# Altium project Camera_Shield.PrjPcb
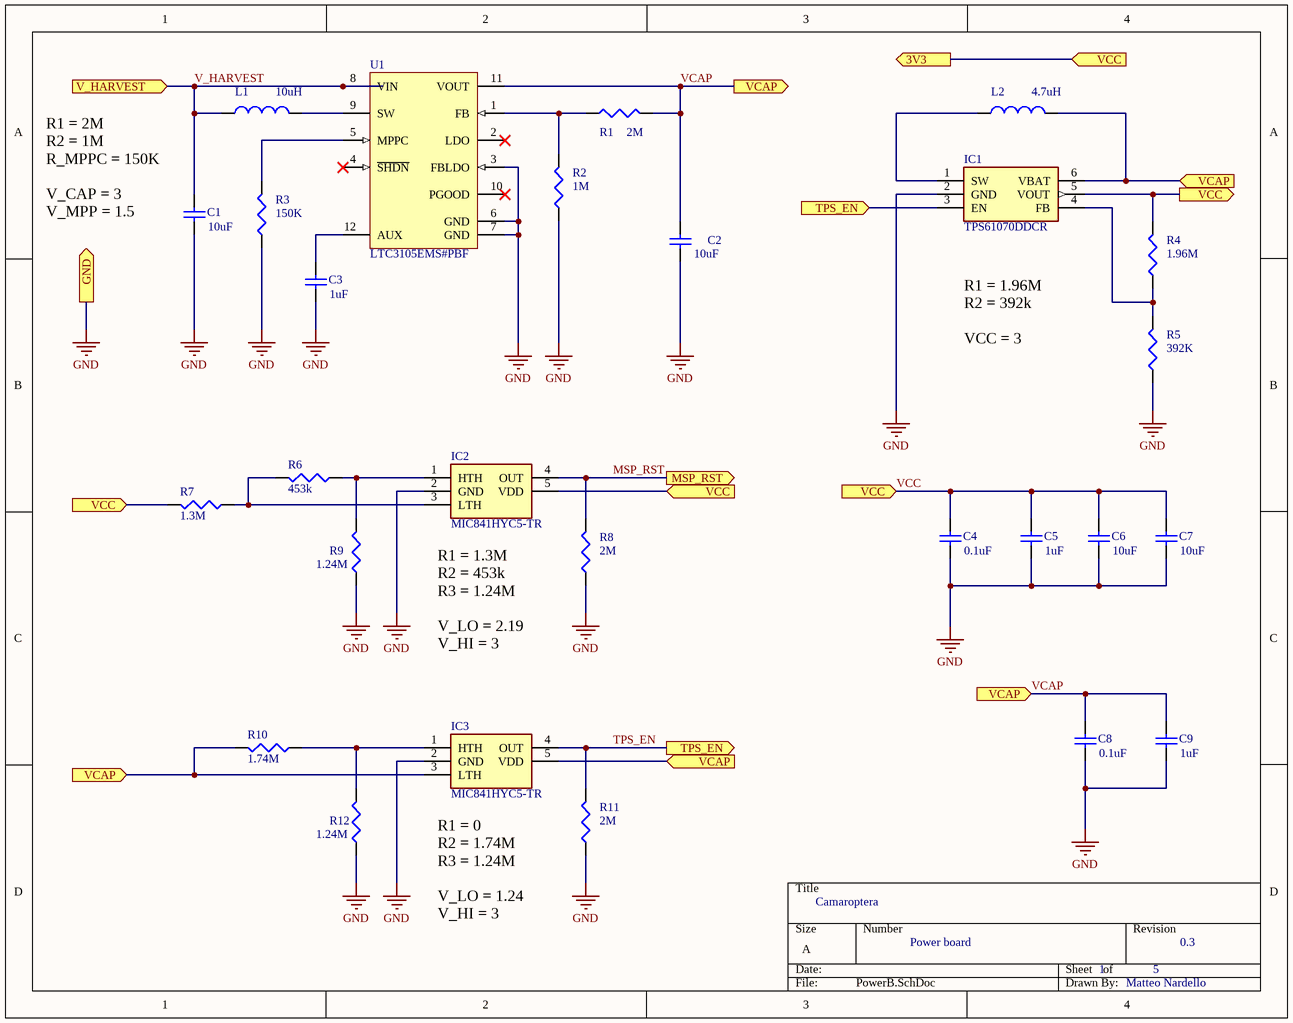
[diagram p0: PowerB.SchDoc]
5 sheets, 52 parts. Net scope: flat (ports and power ports of the same name join across sheets).
Board file: PCB1v3.PcbDoc
Sheets:
  PowerB.SchDoc
  Camera.SchDoc
  Radio.SchDoc
  ALS.SchDoc
  Connectors.SchDoc

## Sheet PowerB.SchDoc
size A

### Parts
C1  value 10uF  [1608[0603]]  (hidden comment: Cap)
C2  value 10uF  [1608[0603]]  (hidden comment: Cap)
C3  value 1uF  [1608[0603]]  (hidden comment: Cap)
C4  value 0.1uF  [1608[0603]]  (hidden comment: Cap)
C5  value 1uF  [1608[0603]]  (hidden comment: Cap)
C6  value 10uF  [1608[0603]]  (hidden comment: Cap)
C7  value 10uF  [1608[0603]]  (hidden comment: Cap)
C8  value 0.1uF  [1608[0603]]  (hidden comment: Cap)
C9  value 1uF  [1608[0603]]  (hidden comment: Cap)
IC1  TPS61070DDCR  [SOT95P280X110-6N]
IC2  MIC841HYC5-TR  [SOT65P210X110-5N]
IC3  MIC841HYC5-TR  [SOT65P210X110-5N]
L1  value 10uH  [C1210]  (hidden comment: Inductor)
L2  value 4.7uH  [C1210]  (hidden comment: Inductor)
R1  value 2M  [1608[0603]]  (hidden comment: Res3)
R2  value 1M  [1608[0603]]  (hidden comment: Res3)
R3  value 150K  [1608[0603]]  (hidden comment: Res3)
R4  value 1.96M  [1608[0603]]  (hidden comment: Res3)
R5  value 392K  [1608[0603]]  (hidden comment: Res3)
R6  value 453k  [1608[0603]]  (hidden comment: Res3)
R7  value 1.3M  [1608[0603]]  (hidden comment: Res3)
R8  value 2M  [1608[0603]]  (hidden comment: Res3)
R9  value 1.24M  [1608[0603]]  (hidden comment: Res3)
R10  value 1.74M  [1608[0603]]  (hidden comment: Res3)
R11  value 2M  [1608[0603]]  (hidden comment: Res3)
R12  value 1.24M  [1608[0603]]  (hidden comment: Res3)
U1  LTC3105EMS#PBF  [LT-MS-12_N]

### Ports
3V3 (out), GND (out), MSP_RST (out), TPS_EN (in), TPS_EN (out), V_HARVEST (in), VCAP (in), VCAP (out), VCC (in), VCC (out)

### Nets
GND: C1.1 C2.1 C3.1 C4.1 C5.1 C6.1 C7.1 C8.1 C9.1 IC1.2(GND) IC2.2(GND) IC3.2(GND) R2.1 R3.1 R5.1 R8.1 R9.1 R11.1 R12.1 U1.3(FBLDO) U1.6(GND) U1.7(GND) ; port GND
MSP_RST: IC2.4(OUT) R8.2 ; port MSP_RST
TPS_EN: IC1.3(EN) IC3.4(OUT) R11.2 ; port TPS_EN
V_HARVEST: C1.2 L1.1 U1.8(VIN) ; port V_HARVEST
VCAP: C2.2 C8.2 C9.2 IC1.6(VBAT) IC3.3(LTH) IC3.5(VDD) L2.2 R1.2 R10.2 U1.11(VOUT) ; port VCAP
VCC: C4.2 C5.2 C6.2 C7.2 IC1.5(VOUT) IC2.5(VDD) R4.2 R7.2 ; port VCC, port 3V3
NetC3_2: C3.2 U1.12(AUX)
NetIC1_1: IC1.1(SW) L2.1
NetIC1_4: IC1.4(FB) R4.1 R5.2
NetIC2_1: IC2.1(HTH) R6.1 R9.2
NetIC2_3: IC2.3(LTH) R6.2 R7.1
NetIC3_1: IC3.1(HTH) R10.1 R12.2
NetL1_2: L1.2 U1.9(SW)
NetR1_1: R1.1 R2.2 U1.1(FB)
NetR3_2: R3.2 U1.5(MPPC)

Not connected (* = marked no-connect by the designer): U1 2(LDO)* 4(~{SHDN})* 10(PGOOD)*

### Notes on the sheet
- (near C1) R1 = 2M
  R2 = 1M
  R_MPPC = 150K
  V_CAP = 3
  V_MPP = 1.5
- R1 = 1.96M
  R2 = 392k
  VCC = 3
- R1 = 1.3M
  R2 = 453k
  R3 = 1.24M
  V_LO = 2.19
  V_HI = 3
- Camaroptera
- R1 = 0
  R2 = 1.74M
  R3 = 1.24M
  V_LO = 1.24
  V_HI = 3
- Power board
- 1
- 5
- 0.3
- Matteo Nardello

### Library data of the parts
C1-C9 = Cap: CAP CER 6.3V X5R/X7R 0603; PackageReference: 0603; Publisher: Altium Limited; PackageDescription: Chip Capacitor, Body 1.6x0.8mm, IPC High Density
IC1 = TPS61070DDCR: 90% Efficient Synchronous Boost Converter With 600-mA Switch; Manufacturer_Name: Texas Instruments; Datasheet Link: http://www.ti.com/lit/ds/symlink/tps61070.pdf; Height: 1.1mm; Mouser Part Number: 595-TPS61070DDCR; Mouser Price/Stock: https://www.mouser.com/Search/Refine.aspx?Keyword=595-TPS61070DDCR; Manufacturer_Part_Number: TPS61070DDCR; ComponentLink1Description: Manufacturer URL; ComponentLink1URL: www.ti.com; ComponentLink2Description: Package Specification; ComponentLink2URL: http://www.ti.com/lit/ml/mpds026l/mpds026l.pdf; ComponentLink3Description: Datasheet; ComponentLink3URL: http://www.ti.com/lit/ds/symlink/tps61070.pdf
IC2 IC3 = MIC841HYC5-TR: Comparator with 1.25% Reference and Adjustable Hysteresis; Manufacturer_Name: Microchip; Datasheet Link: http://ww1.microchip.com/downloads/en/devicedoc/20005758a.pdf; Height: 1.1mm; Manufacturer_Part_Number: MIC841HYC5-TR; Mouser Part Number: 998-MIC841HYC5TR; RS Part Number: 1654292; RS Price/Stock: http://uk.rs-online.com/web/p/products/1654292; ComponentLink2Description: Package Specification; ComponentLink2URL: http://94.251.15.129/chip/ChipDoc.nsf/Package/4907A36056EE3CAB47257B96006A2837!OpenDocument
  IC2: ComponentLink1Description: Manufacturer URL; ComponentLink1URL: https://www.microchip.com; ComponentLink3Description: Datasheet; ComponentLink3URL: http://ww1.microchip.com/downloads/en/devicedoc/20005758a.pdf
  IC3: ComponentLink1Description: Datasheet; ComponentLink1URL: http://ww1.microchip.com/downloads/en/devicedoc/20005758a.pdf; ComponentLink3Description: Manufacturer URL; ComponentLink3URL: https://www.microchip.com
L1 = Inductor: Part: CBC3225T100KR; Code_IEC: 3225; Published: 8-Jun-2000; LatestRevisionDate: 29-May-2009; LatestRevisionNote: IPC-7351 Footprint Added.; PackageReference: 1210; Publisher: Altium Limited; PackageDescription: Chip Inductor; Code_JEITA: 1210
L2 = Inductor: Part: CBC3225T4R7MR; Code_IEC: 3225; Published: 8-Jun-2000; LatestRevisionDate: 29-May-2009; LatestRevisionNote: IPC-7351 Footprint Added.; PackageReference: 1210; Publisher: Altium Limited; PackageDescription: Chip Inductor; Code_JEITA: 1210
R1-R12 = Res3: RES 1/10W 1% 0603 SMD; PackageReference: 0603; Publisher: Altium Limited; PackageDescription: Chip Resistor, Body 1.6x0.8mm, IPC High Density
U1 = CMP-0473-00104-1: 400 mA Step-Up DC/DC Converter with Maximum Power Point Control and 250 mV Start-Up, 12-pin SOP (MS-12), -40 to 85 degC, Pb-Free; Manufacturer: Linear Technology; Number of Outputs: 1; Vin Min(V): 0.225; Topology: Boost; Vin Max(V): 5; Vout Max(V): 5.25; Energy Source: Solar; Mounting Technology: Surface Mount; PackageVersion: Rev. A, 05/2013; PartNumber: LTC3105EMS#PBF; RoHS: TRUE; PackageDescription: 12-Pin Plastic MSOP, Body 4.039 x 3 mm, Pitch 0.65 mm; ComponentLink1Description: Manufacturer URL; DatasheetVersion: Rev. A; ComponentLink1URL: http://www.linear.com/; ComponentLink3Description: Package Specification; ComponentLink2URL: https://www.analog.com/media/en/technical-documentation/data-sheets/3105fb.pdf; ComponentLink3URL: http://cds.linear.com/docs/en/packaging/05081668_A_MS12.pdf; PackageReference: MS-12; ComponentLink2Description: Datasheet

## Sheet Camera.SchDoc
size A
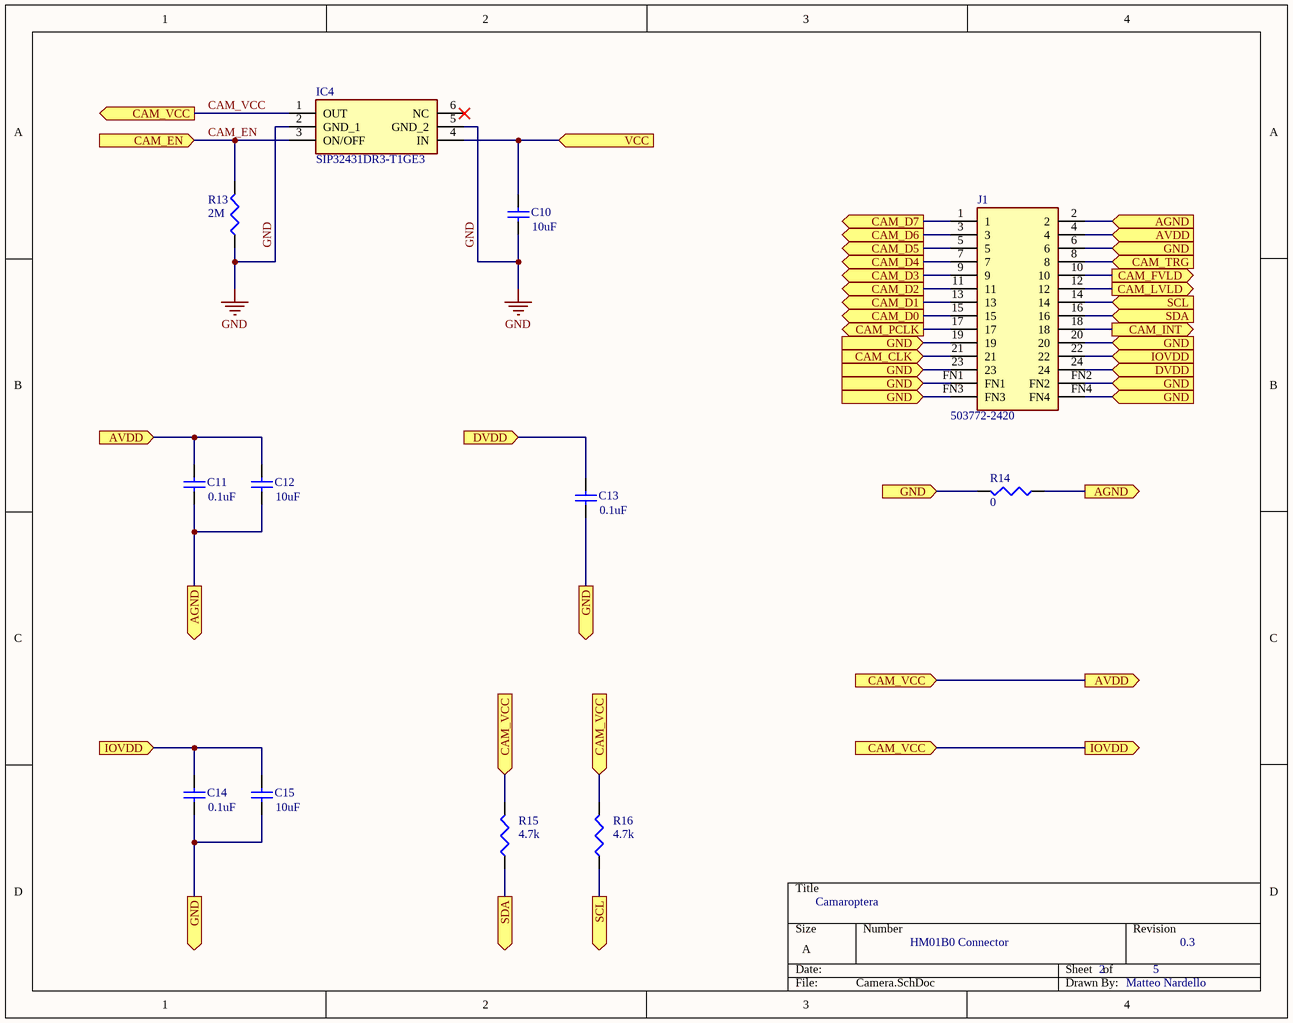
[diagram p1: Camera.SchDoc]

### Parts
C10  value 10uF  [1608[0603]]  (hidden comment: Cap)
C11  value 0.1uF  [1608[0603]]  (hidden comment: Cap)
C12  value 10uF  [1608[0603]]  (hidden comment: Cap)
C13  value 0.1uF  [1608[0603]]  (hidden comment: Cap)
C14  value 0.1uF  [1608[0603]]  (hidden comment: Cap)
C15  value 10uF  [1608[0603]]  (hidden comment: Cap)
IC4  SIP32431DR3-T1GE3  [SOT65P210X110-6N]
J1  503772-2420  [5037722410]
R13  value 2M  [J1-0603]  (hidden comment: Res3)
R14  value 0  [J1-0603]  (hidden comment: Res3)
R15  value 4.7k  [J1-0603]  (hidden comment: Res3)
R16  value 4.7k  [J1-0603]  (hidden comment: Res3)

### Ports
AGND (in), AGND (out), AVDD (in), AVDD (out), CAM_CLK (in), CAM_D0 (out), CAM_D1 (out), CAM_D2 (out), CAM_D3 (out), CAM_D4 (out), CAM_D5 (out), CAM_D6 (out), CAM_D7 (out), CAM_EN (in), CAM_FVLD (out), CAM_INT (out), CAM_LVLD (out), CAM_PCLK (out), CAM_TRG (in), CAM_VCC (in), CAM_VCC (out), DVDD (in), GND (in), GND (out), IOVDD (in), IOVDD (out), SCL (in), SCL (out), SDA (in), SDA (out), VCC (in)

### Nets
GND: C10.1 C13.1 C14.1 C15.1 IC4.2(GND_1) IC4.5(GND_2) J1.6 J1.19 J1.20 J1.23 J1.FN1 J1.FN2 J1.FN3 J1.FN4 R13.1 R14.2 ; port GND
CAM_EN: IC4.3(ON/OFF) R13.2 ; port CAM_EN
CAM_VCC: C11.2 C12.2 C14.2 C15.2 IC4.1(OUT) J1.4 J1.22 R15.2 R16.2 ; port CAM_VCC, port AVDD, port IOVDD
VCC: C10.2 IC4.4(IN) ; port VCC
NetC11_1: C11.1 C12.1 J1.2 R14.1 ; port AGND
NetC13_2: C13.2 J1.24 ; port DVDD
NetJ1_1: J1.1 ; port CAM_D7
NetJ1_3: J1.3 ; port CAM_D6
NetJ1_5: J1.5 ; port CAM_D5
NetJ1_7: J1.7 ; port CAM_D4
NetJ1_8: J1.8 ; port CAM_TRG
NetJ1_9: J1.9 ; port CAM_D3
NetJ1_10: J1.10 ; port CAM_FVLD
NetJ1_11: J1.11 ; port CAM_D2
NetJ1_12: J1.12 ; port CAM_LVLD
NetJ1_13: J1.13 ; port CAM_D1
NetJ1_14: J1.14 R16.1 ; port SCL
NetJ1_15: J1.15 ; port CAM_D0
NetJ1_16: J1.16 R15.1 ; port SDA
NetJ1_17: J1.17 ; port CAM_PCLK
NetJ1_18: J1.18 ; port CAM_INT
NetJ1_21: J1.21 ; port CAM_CLK

Not connected (* = marked no-connect by the designer): IC4 6(NC)*

### Notes on the sheet
- Camaroptera
- HM01B0 Connector
- 2
- 5
- 0.3
- Matteo Nardello

### Library data of the parts
C10-C15 = Cap: CAP CER 6.3V X5R/X7R 0603; PackageReference: 0603; Publisher: Altium Limited; PackageDescription: Chip Capacitor, Body 1.6x0.8mm, IPC High Density
IC4 = SIP32431DR3-T1GE3: 10 pA, Ultra Low Leakage and Quiescent Current, / Load Switch with Reverse Blocking; Manufacturer_Name: Vishay; Datasheet Link: https://componentsearchengine.com/Datasheets/1/SIP32431DR3-T1GE3.pdf; Height: 1.1mm; Mouser Part Number: 781-SIP32431DR3-GE3; Mouser Price/Stock: https://www.mouser.com/Search/Refine.aspx?Keyword=781-SIP32431DR3-GE3; Manufacturer_Part_Number: SIP32431DR3-T1GE3; ComponentLink1Description: Datasheet; ComponentLink1URL: https://www.vishay.com/docs/66597/sip32431.pdf; ComponentLink2Description: Package Specification; ComponentLink2URL: https://www.vishay.com/docs/71154/71154.pdf; ComponentLink3Description: Manufacturer URL; ComponentLink3URL: https://www.vishay.com
J1 = 503772-2410: SlimStack Board-to-Board Connector. 0.40mm Pitch, B8 Series, Receptacle, 0.80mm Mated Height, 2.50mm Mated Width, 24 Circuits; Manufacturer_Name: Molex; Datasheet Link: https://componentsearchengine.com/Datasheets/1/503772-2410.pdf; Height: 0.76mm; Mouser Part Number: 538-503772-2410; Mouser Price/Stock: https://www.mouser.com/Search/Refine.aspx?Keyword=538-503772-2410; Manufacturer_Part_Number: 503772-2410; ComponentLink1Description: Package Specification; ComponentLink1URL: https://www.molex.com/pdm_docs/sd/5037722420_sd.pdf; ComponentLink2Description: Manufacturer URL; ComponentLink2URL: https://www.molex.com; ComponentLink3Description: Datasheet; ComponentLink3URL: https://www.molex.com/webdocs/datasheets/pdf/en-us/5037722420_PCB_RECEPTACLES.pdf
R13-R16 = Res3: RES 1/10W 1% 0603 SMD; PackageReference: 0603; Publisher: Altium Limited; PackageDescription: Chip Resistor, Body 1.6x0.8mm, IPC High Density

## Sheet Radio.SchDoc
size A
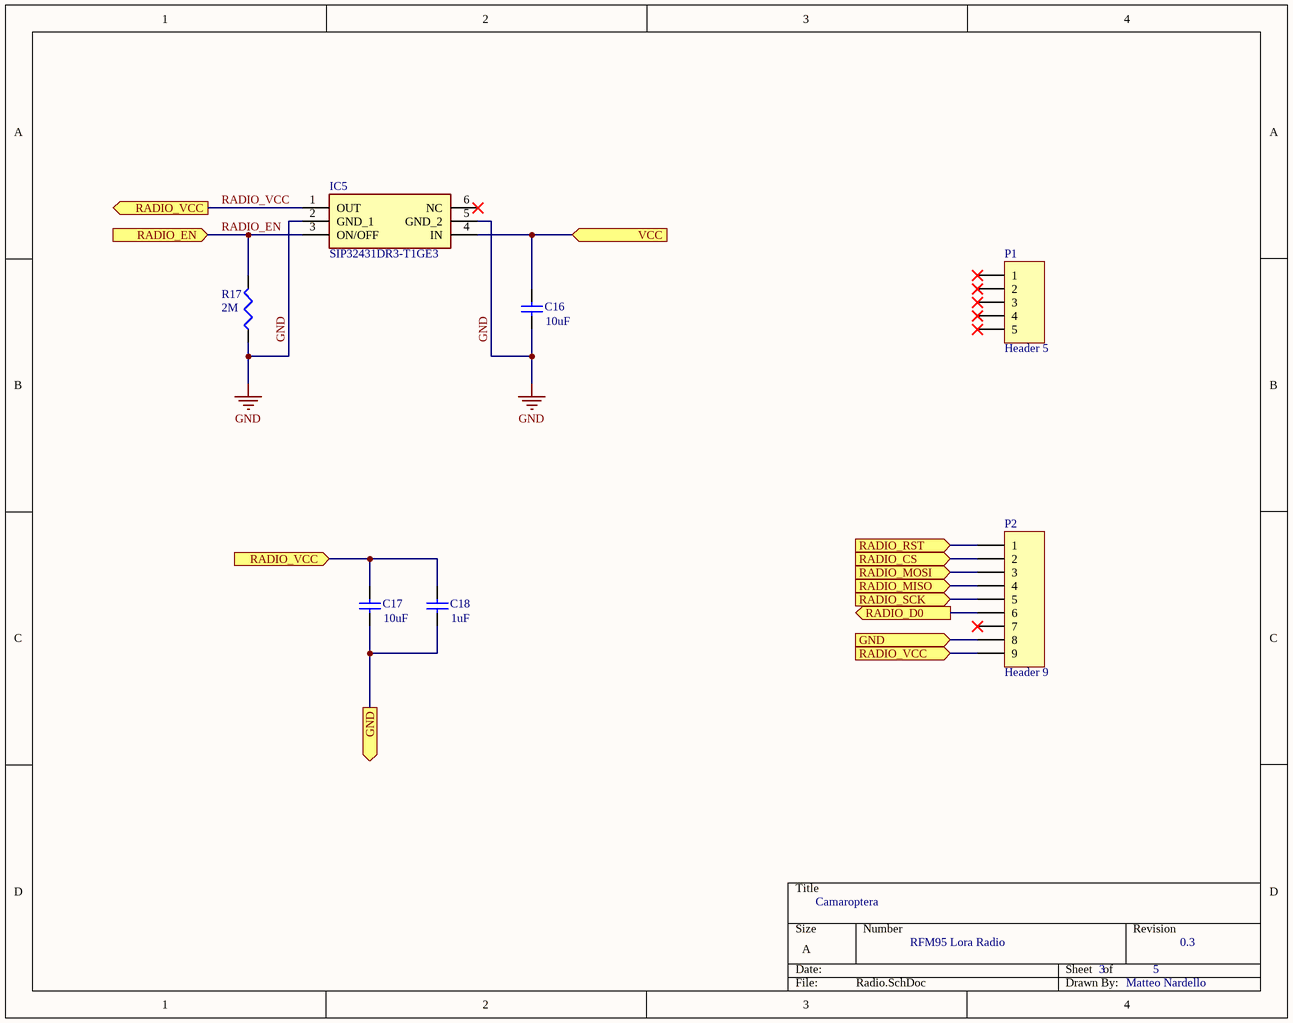
[diagram p2: Radio.SchDoc]

### Parts
C16  value 10uF  [1608[0603]]  (hidden comment: Cap)
C17  value 10uF  [1608[0603]]  (hidden comment: Cap)
C18  value 1uF  [1608[0603]]  (hidden comment: Cap)
IC5  SIP32431DR3-T1GE3  [SOT65P210X110-6N]
P1  Header 5  [HDR1X5]
P2  Header 9  [HDR1X9]
R17  value 2M  [J1-0603]  (hidden comment: Res3)

### Ports
GND (in), GND (out), RADIO_CS (in), RADIO_D0 (out), RADIO_EN (in), RADIO_MISO (in), RADIO_MOSI (in), RADIO_RST (in), RADIO_SCK (in), RADIO_VCC (in), RADIO_VCC (out), VCC (in)

### Nets
GND: C16.1 C17.1 C18.1 IC5.2(GND_1) IC5.5(GND_2) P2.8 R17.1 ; port GND
RADIO_EN: IC5.3(ON/OFF) R17.2 ; port RADIO_EN
RADIO_VCC: C17.2 C18.2 IC5.1(OUT) P2.9 ; port RADIO_VCC
VCC: C16.2 IC5.4(IN) ; port VCC
NetP2_1: P2.1 ; port RADIO_RST
NetP2_2: P2.2 ; port RADIO_CS
NetP2_3: P2.3 ; port RADIO_MOSI
NetP2_4: P2.4 ; port RADIO_MISO
NetP2_5: P2.5 ; port RADIO_SCK
NetP2_6: P2.6 ; port RADIO_D0

Not connected (* = marked no-connect by the designer): IC5 6(NC)*; P1 1* 2* 3* 4* 5*; P2 7*

### Notes on the sheet
- Camaroptera
- RFM95 Lora Radio
- 3
- 5
- 0.3
- Matteo Nardello

### Library data of the parts
C16-C18 = Cap: CAP CER 6.3V X5R/X7R 0603; PackageReference: 0603; Publisher: Altium Limited; PackageDescription: Chip Capacitor, Body 1.6x0.8mm, IPC High Density
IC5 = SIP32431DR3-T1GE3: as IC4 on sheet Camera; Datasheet Link: https://componentsearchengine.com/Datasheets/1/SIP32431DR3-T1GE3.pdf; Height: 1.1mm; Mouser Part Number: 781-SIP32431DR3-GE3; Mouser Price/Stock: https://www.mouser.com/Search/Refine.aspx?Keyword=781-SIP32431DR3-GE3; Manufacturer_Part_Number: SIP32431DR3-T1GE3; ComponentLink1Description: Datasheet; ComponentLink1URL: https://www.vishay.com/docs/66597/sip32431.pdf; ComponentLink2Description: Package Specification; ComponentLink2URL: https://www.vishay.com/docs/71154/71154.pdf; ComponentLink3Description: Manufacturer URL; ComponentLink3URL: https://www.vishay.com
P1 = Header 5: Header, 5-Pin; LatestRevisionDate: 17-Jul-2002; LatestRevisionNote: Re-released for DXP Platform.; Publisher: Altium Limited
P2 = Header 9: Header, 9-Pin; LatestRevisionDate: 17-Jul-2002; LatestRevisionNote: Re-released for DXP Platform.; Publisher: Altium Limited
R17 = Res3: RES 1/10W 1% 0603 SMD; PackageReference: 0603; Publisher: Altium Limited; PackageDescription: Chip Resistor, Body 1.6x0.8mm, IPC High Density

## Sheet ALS.SchDoc
size A
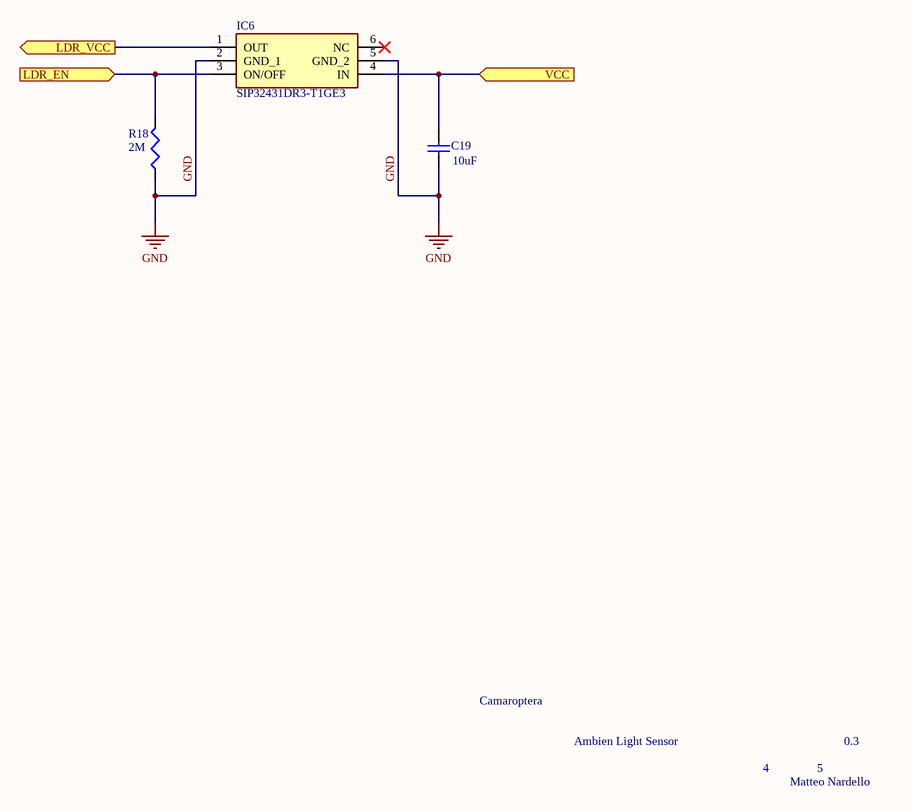
[diagram p3: ALS.SchDoc]

### Parts
C19  value 10uF  [1608[0603]]  (hidden comment: Cap)
IC6  SIP32431DR3-T1GE3  [SOT65P210X110-6N]
R18  value 2M  [J1-0603]  (hidden comment: Res3)

### Ports
LDR_EN (in), LDR_VCC (out), VCC (in)

### Nets
GND: C19.1 IC6.2(GND_1) IC6.5(GND_2) R18.1
VCC: C19.2 IC6.4(IN) ; port VCC
NetIC6_1: IC6.1(OUT) ; port LDR_VCC
NetIC6_3: IC6.3(ON/OFF) R18.2 ; port LDR_EN

Not connected (* = marked no-connect by the designer): IC6 6(NC)*

### Notes on the sheet
- Camaroptera
- Ambien Light Sensor
- 4
- 5
- 0.3
- Matteo Nardello

### Library data of the parts
C19 = Cap: CAP CER 6.3V X5R/X7R 0603; PackageReference: 0603; Publisher: Altium Limited; PackageDescription: Chip Capacitor, Body 1.6x0.8mm, IPC High Density
IC6 = SIP32431DR3-T1GE3: as IC4 on sheet Camera; Datasheet Link: https://componentsearchengine.com/Datasheets/1/SIP32431DR3-T1GE3.pdf; Height: 1.1mm; Mouser Part Number: 781-SIP32431DR3-GE3; Mouser Price/Stock: https://www.mouser.com/Search/Refine.aspx?Keyword=781-SIP32431DR3-GE3; Manufacturer_Part_Number: SIP32431DR3-T1GE3; ComponentLink1Description: Datasheet; ComponentLink1URL: https://www.vishay.com/docs/66597/sip32431.pdf; ComponentLink2Description: Package Specification; ComponentLink2URL: https://www.vishay.com/docs/71154/71154.pdf; ComponentLink3Description: Manufacturer URL; ComponentLink3URL: https://www.vishay.com
R18 = Res3: RES 1/10W 1% 0603 SMD; PackageReference: 0603; Publisher: Altium Limited; PackageDescription: Chip Resistor, Body 1.6x0.8mm, IPC High Density

## Sheet Connectors.SchDoc
size A
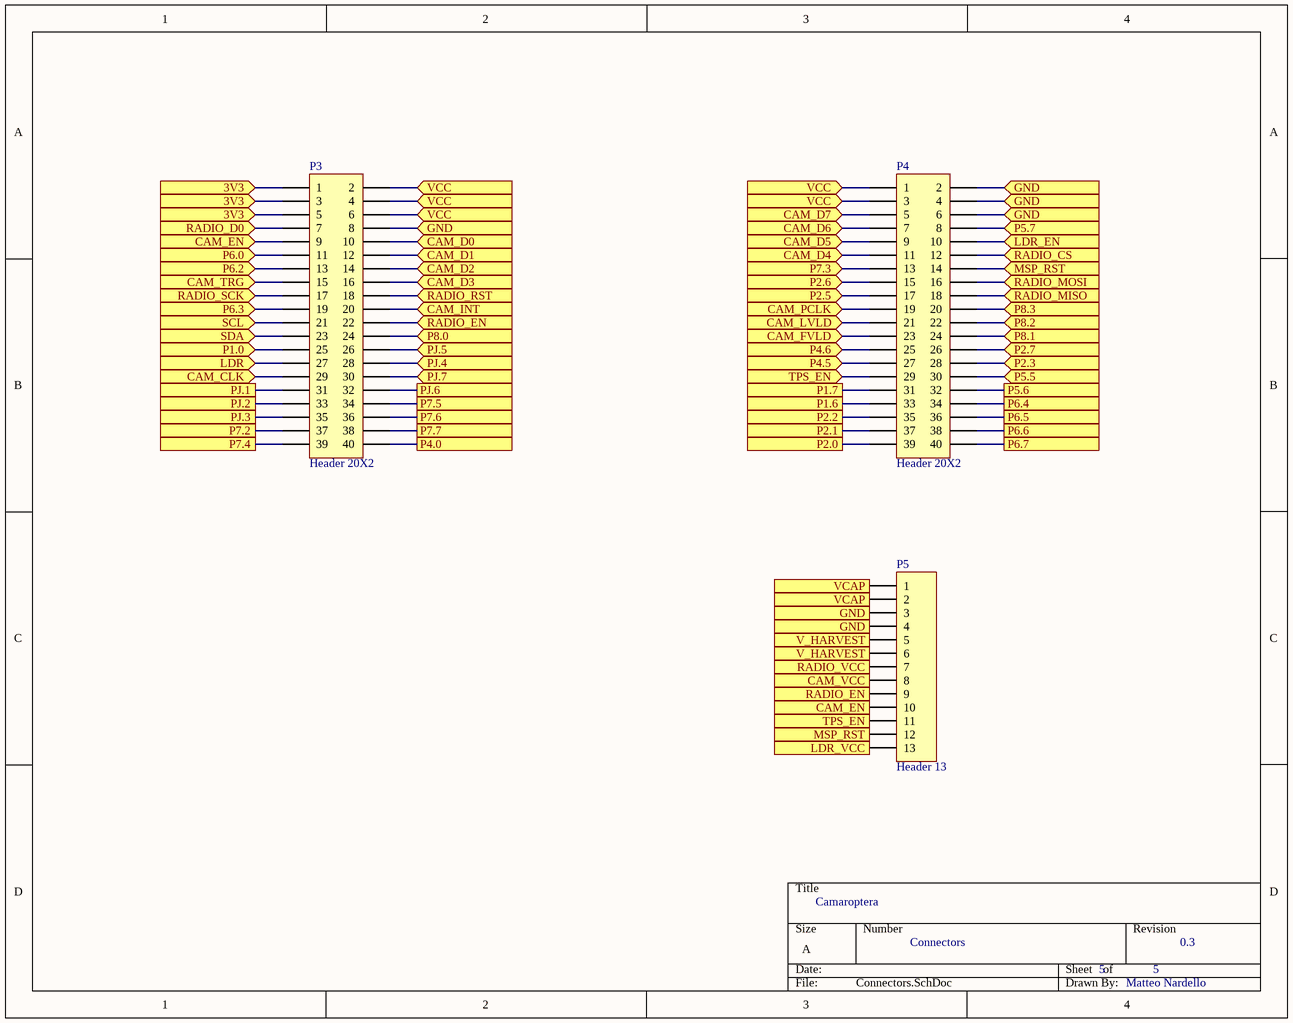
[diagram p4: Connectors.SchDoc]

### Parts
P3  Header 20X2  [HDR2X20]
P4  Header 20X2  [HDR2X20]
P5  Header 13  [HDR1X13]

### Ports
3V3 (in), CAM_CLK (in), CAM_D0 (in), CAM_D1 (in), CAM_D2 (in), CAM_D3 (in), CAM_D4 (in), CAM_D5 (in), CAM_D6 (in), CAM_D7 (in), CAM_EN (in), CAM_EN (out), CAM_FVLD (in), CAM_INT (in), CAM_LVLD (in), CAM_PCLK (in), CAM_TRG (in), CAM_VCC (out), GND (in), GND (out), LDR (in), LDR_EN (in), LDR_VCC (in), MSP_RST (in), MSP_RST (out), P1.0 (in), P1.6, P1.7, P2.0, P2.1, P2.2, P2.3 (in), P2.5 (in), P2.6 (in), P2.7 (in), P4.0, P4.5 (in), P4.6 (in), P5.5 (in), P5.6, P5.7 (in), P6.0 (in), P6.2 (in), P6.3 (in), P6.4, P6.5, P6.6, P6.7, P7.2, P7.3 (in), P7.4, P7.5, P7.6, P7.7, P8.0 (in), P8.1 (in), P8.2 (in), P8.3 (in), PJ.1, PJ.2, PJ.3, PJ.4 (in), PJ.5 (in), PJ.6, PJ.7 (in), RADIO_CS (in), RADIO_D0 (in), RADIO_EN (in), RADIO_EN (out), RADIO_MISO (in), RADIO_MOSI (in), RADIO_RST (in), RADIO_SCK (in), RADIO_VCC (out), SCL (in), SDA (in), TPS_EN (in), TPS_EN (out), V_HARVEST (in), V_HARVEST (out), VCAP (in), VCAP (out), VCC (in)

### Nets
GND: P3.8 P4.2 P4.4 P4.6 P5.3 P5.4 ; port GND
CAM_EN: P3.9 P5.10 ; port CAM_EN
CAM_VCC: P5.8 ; port CAM_VCC
MSP_RST: P4.14 P5.12 ; port MSP_RST
RADIO_EN: P3.22 P5.9 ; port RADIO_EN
RADIO_VCC: P5.7 ; port RADIO_VCC
TPS_EN: P4.29 P5.11 ; port TPS_EN
V_HARVEST: P5.5 P5.6 ; port V_HARVEST
VCAP: P5.1 P5.2 ; port VCAP
VCC: P3.1 P3.2 P3.3 P3.4 P3.5 P3.6 P4.1 P4.3 ; port 3V3, port VCC
NetIC6_1: P5.13 ; port LDR_VCC
NetIC6_3: P4.10 ; port LDR_EN
NetJ1_1: P4.5 ; port CAM_D7
NetJ1_3: P4.7 ; port CAM_D6
NetJ1_5: P4.9 ; port CAM_D5
NetJ1_7: P4.11 ; port CAM_D4
NetJ1_8: P3.15 ; port CAM_TRG
NetJ1_9: P3.16 ; port CAM_D3
NetJ1_10: P4.23 ; port CAM_FVLD
NetJ1_11: P3.14 ; port CAM_D2
NetJ1_12: P4.21 ; port CAM_LVLD
NetJ1_13: P3.12 ; port CAM_D1
NetJ1_14: P3.21 ; port SCL
NetJ1_15: P3.10 ; port CAM_D0
NetJ1_16: P3.23 ; port SDA
NetJ1_17: P4.19 ; port CAM_PCLK
NetJ1_18: P3.20 ; port CAM_INT
NetJ1_21: P3.29 ; port CAM_CLK
NetP2_1: P3.18 ; port RADIO_RST
NetP2_2: P4.12 ; port RADIO_CS
NetP2_3: P4.16 ; port RADIO_MOSI
NetP2_4: P4.18 ; port RADIO_MISO
NetP2_5: P3.17 ; port RADIO_SCK
NetP2_6: P3.7 ; port RADIO_D0
NetP3_11: P3.11 ; port P6.0
NetP3_13: P3.13 ; port P6.2
NetP3_19: P3.19 ; port P6.3
NetP3_24: P3.24 ; port P8.0
NetP3_25: P3.25 ; port P1.0
NetP3_26: P3.26 ; port PJ.5
NetP3_27: P3.27 ; port LDR
NetP3_28: P3.28 ; port PJ.4
NetP3_30: P3.30 ; port PJ.7
NetP3_31: P3.31 ; port PJ.1
NetP3_32: P3.32 ; port PJ.6
NetP3_33: P3.33 ; port PJ.2
NetP3_34: P3.34 ; port P7.5
NetP3_35: P3.35 ; port PJ.3
NetP3_36: P3.36 ; port P7.6
NetP3_37: P3.37 ; port P7.2
NetP3_38: P3.38 ; port P7.7
NetP3_39: P3.39 ; port P7.4
NetP3_40: P3.40 ; port P4.0
NetP4_8: P4.8 ; port P5.7
NetP4_13: P4.13 ; port P7.3
NetP4_15: P4.15 ; port P2.6
NetP4_17: P4.17 ; port P2.5
NetP4_20: P4.20 ; port P8.3
NetP4_22: P4.22 ; port P8.2
NetP4_24: P4.24 ; port P8.1
NetP4_25: P4.25 ; port P4.6
NetP4_26: P4.26 ; port P2.7
NetP4_27: P4.27 ; port P4.5
NetP4_28: P4.28 ; port P2.3
NetP4_30: P4.30 ; port P5.5
NetP4_31: P4.31 ; port P1.7
NetP4_32: P4.32 ; port P5.6
NetP4_33: P4.33 ; port P1.6
NetP4_34: P4.34 ; port P6.4
NetP4_35: P4.35 ; port P2.2
NetP4_36: P4.36 ; port P6.5
NetP4_37: P4.37 ; port P2.1
NetP4_38: P4.38 ; port P6.6
NetP4_39: P4.39 ; port P2.0
NetP4_40: P4.40 ; port P6.7

### Notes on the sheet
- Camaroptera
- Connectors
- 5
- 0.3
- Matteo Nardello

### Library data of the parts
P3 P4 = Header 20X2: Header, 20-Pin, Dual row; LatestRevisionDate: 17-Jul-2002; LatestRevisionNote: Re-released for DXP Platform.; Publisher: Altium Limited
P5 = Header 13: Header, 13-Pin; LatestRevisionDate: 17-Jul-2002; LatestRevisionNote: Re-released for DXP Platform.; Publisher: Altium Limited

## Nets that join several sheets
GND: PowerB (22 pins), Camera (16 pins), Radio (7 pins), ALS (C19.1 IC6.2 IC6.5 R18.1), Connectors (6 pins)
CAM_EN: Camera (IC4.3 R13.2), Connectors (P3.9 P5.10)
CAM_VCC: Camera (9 pins), Connectors (P5.8)
MSP_RST: PowerB (IC2.4 R8.2), Connectors (P4.14 P5.12)
NetIC6_1: ALS (IC6.1), Connectors (P5.13)
NetIC6_3: ALS (IC6.3 R18.2), Connectors (P4.10)
NetJ1_1: Camera (J1.1), Connectors (P4.5)
NetJ1_3: Camera (J1.3), Connectors (P4.7)
NetJ1_5: Camera (J1.5), Connectors (P4.9)
NetJ1_7: Camera (J1.7), Connectors (P4.11)
NetJ1_8: Camera (J1.8), Connectors (P3.15)
NetJ1_9: Camera (J1.9), Connectors (P3.16)
NetJ1_10: Camera (J1.10), Connectors (P4.23)
NetJ1_11: Camera (J1.11), Connectors (P3.14)
NetJ1_12: Camera (J1.12), Connectors (P4.21)
NetJ1_13: Camera (J1.13), Connectors (P3.12)
NetJ1_14: Camera (J1.14 R16.1), Connectors (P3.21)
NetJ1_15: Camera (J1.15), Connectors (P3.10)
NetJ1_16: Camera (J1.16 R15.1), Connectors (P3.23)
NetJ1_17: Camera (J1.17), Connectors (P4.19)
NetJ1_18: Camera (J1.18), Connectors (P3.20)
NetJ1_21: Camera (J1.21), Connectors (P3.29)
NetP2_1: Radio (P2.1), Connectors (P3.18)
NetP2_2: Radio (P2.2), Connectors (P4.12)
NetP2_3: Radio (P2.3), Connectors (P4.16)
NetP2_4: Radio (P2.4), Connectors (P4.18)
NetP2_5: Radio (P2.5), Connectors (P3.17)
NetP2_6: Radio (P2.6), Connectors (P3.7)
RADIO_EN: Radio (IC5.3 R17.2), Connectors (P3.22 P5.9)
RADIO_VCC: Radio (C17.2 C18.2 IC5.1 P2.9), Connectors (P5.7)
TPS_EN: PowerB (IC1.3 IC3.4 R11.2), Connectors (P4.29 P5.11)
V_HARVEST: PowerB (C1.2 L1.1 U1.8), Connectors (P5.5 P5.6)
VCAP: PowerB (10 pins), Connectors (P5.1 P5.2)
VCC: PowerB (8 pins), Camera (C10.2 IC4.4), Radio (C16.2 IC5.4), ALS (C19.2 IC6.4), Connectors (8 pins)